# Altium schematic sheet LoRa_Sender.SchDoc
size A
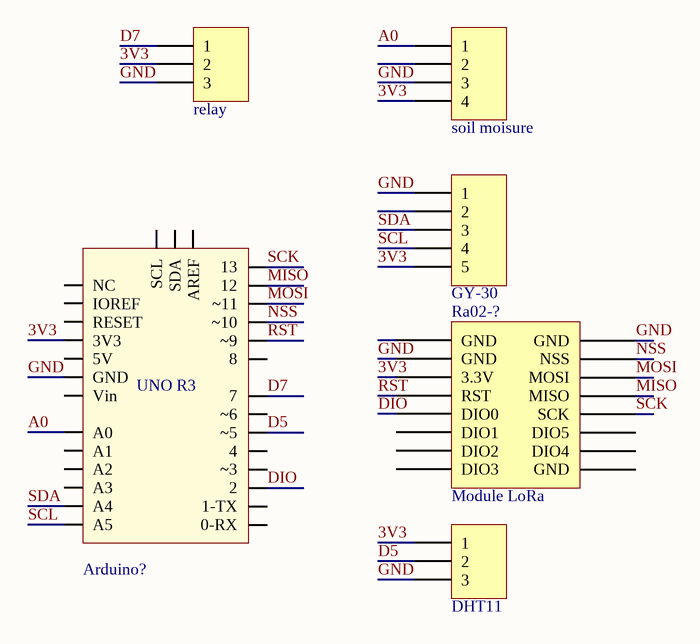
[diagram p0: LoRa_Sender.SchDoc]

## Parts
Arduino?  Arduino Uno R3  [Arduino UNO R3]  (value not drawn)
DHT11  Header 3  [JP3]  (value not drawn)
GY-30  Header 5  [JP5]  (value not drawn)
Ra02-?  Module LoRa  [Module LoRa Ra02]
relay  Header 3  [JP3]  (value not drawn)
soil_moisure  Header 4  [JP4]  (value not drawn)

## Nets
3V3: Arduino?.3V3 DHT11.1 GY-30.5 Ra02-?.3(3.3V) relay.2 soil_moisure.4
A0: Arduino?.A0 soil_moisure.1
D5: Arduino?.~5 DHT11.2
D7: Arduino?.7 relay.1
DIO: Arduino?.2 Ra02-?.5(DIO0)
GND: Arduino?.GND DHT11.3 GY-30.1 Ra02-?.2(GND) Ra02-?.16(GND) relay.3 soil_moisure.3
MISO: Arduino?.12 Ra02-?.13(MISO)
MOSI: Arduino?.~11 Ra02-?.14(MOSI)
NSS: Arduino?.~10 Ra02-?.15(NSS)
RST: Arduino?.~9 Ra02-?.4(RST)
SCK: Arduino?.13 Ra02-?.12(SCK)
SCL: Arduino?.A5 GY-30.4
SDA: Arduino?.A4 GY-30.3

Not connected (* = marked no-connect by the designer): Arduino? 0-RX 1-TX 4 5V 8 A1 A2 A3 AREF IOREF NC RESET SCL SDA Vin ~3 ~6; GY-30 2; Ra02-? 1(GND) 6(DIO1) 7(DIO2) 8(DIO3) 9(GND) 10(DIO4) 11(DIO5); soil_moisure 2

## Notes on the sheet
- (in symbol Arduino Uno R3) UNO R3

## Library data of the parts
Arduino? = Arduino Uno R3: Value: Cau 1A
DHT11 relay = Header 3: Header, 3-Pin; LatestRevisionDate: 17-Jul-2002; LatestRevisionNote: Re-released for DXP Platform.; Publisher: Altium Limited
GY-30 = Header 5: Header, 5-Pin; LatestRevisionDate: 17-Jul-2002; LatestRevisionNote: Re-released for DXP Platform.; Publisher: Altium Limited
Ra02-? = Module LoRa Ra02
soil_moisure = Header 4: Header, 4-Pin; LatestRevisionDate: 17-Jul-2002; LatestRevisionNote: Re-released for DXP Platform.; Publisher: Altium Limited